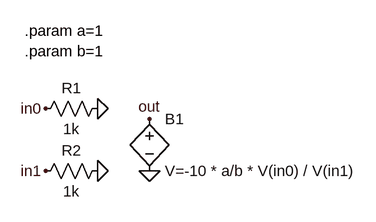
[diagram p0: schematic divider.asc]
divider.asc, the LTspice schematic file:
Version 4
SHEET 1 880 680
FLAG 64 48 in0
FLAG 144 48 0
FLAG 64 144 in1
FLAG 144 144 0
FLAG 224 144 0
FLAG 224 64 out
SYMBOL res 160 32 R90
WINDOW 0 0 56 VBottom 2
WINDOW 3 32 56 VTop 2
SYMATTR InstName R1
SYMATTR Value 1k
SYMBOL res 160 128 R90
WINDOW 0 0 56 VBottom 2
WINDOW 3 32 56 VTop 2
SYMATTR InstName R2
SYMATTR Value 1k
SYMBOL bv 224 48 R0
SYMATTR InstName B1
SYMATTR Value V=-10 * a/b * V(in0) / V(in1)
TEXT 32 -72 Left 2 !.param a=1\n.param b=1

The netlist it stands for:
* divider.asc
R1 0 in0 1k
R2 0 in1 1k
B1 out 0 V=-10 * a/b * V(in0) / V(in1)
.param a=1
.param b=1
.backanno
.end